# Altium project phase-4-badge.PrjPcb
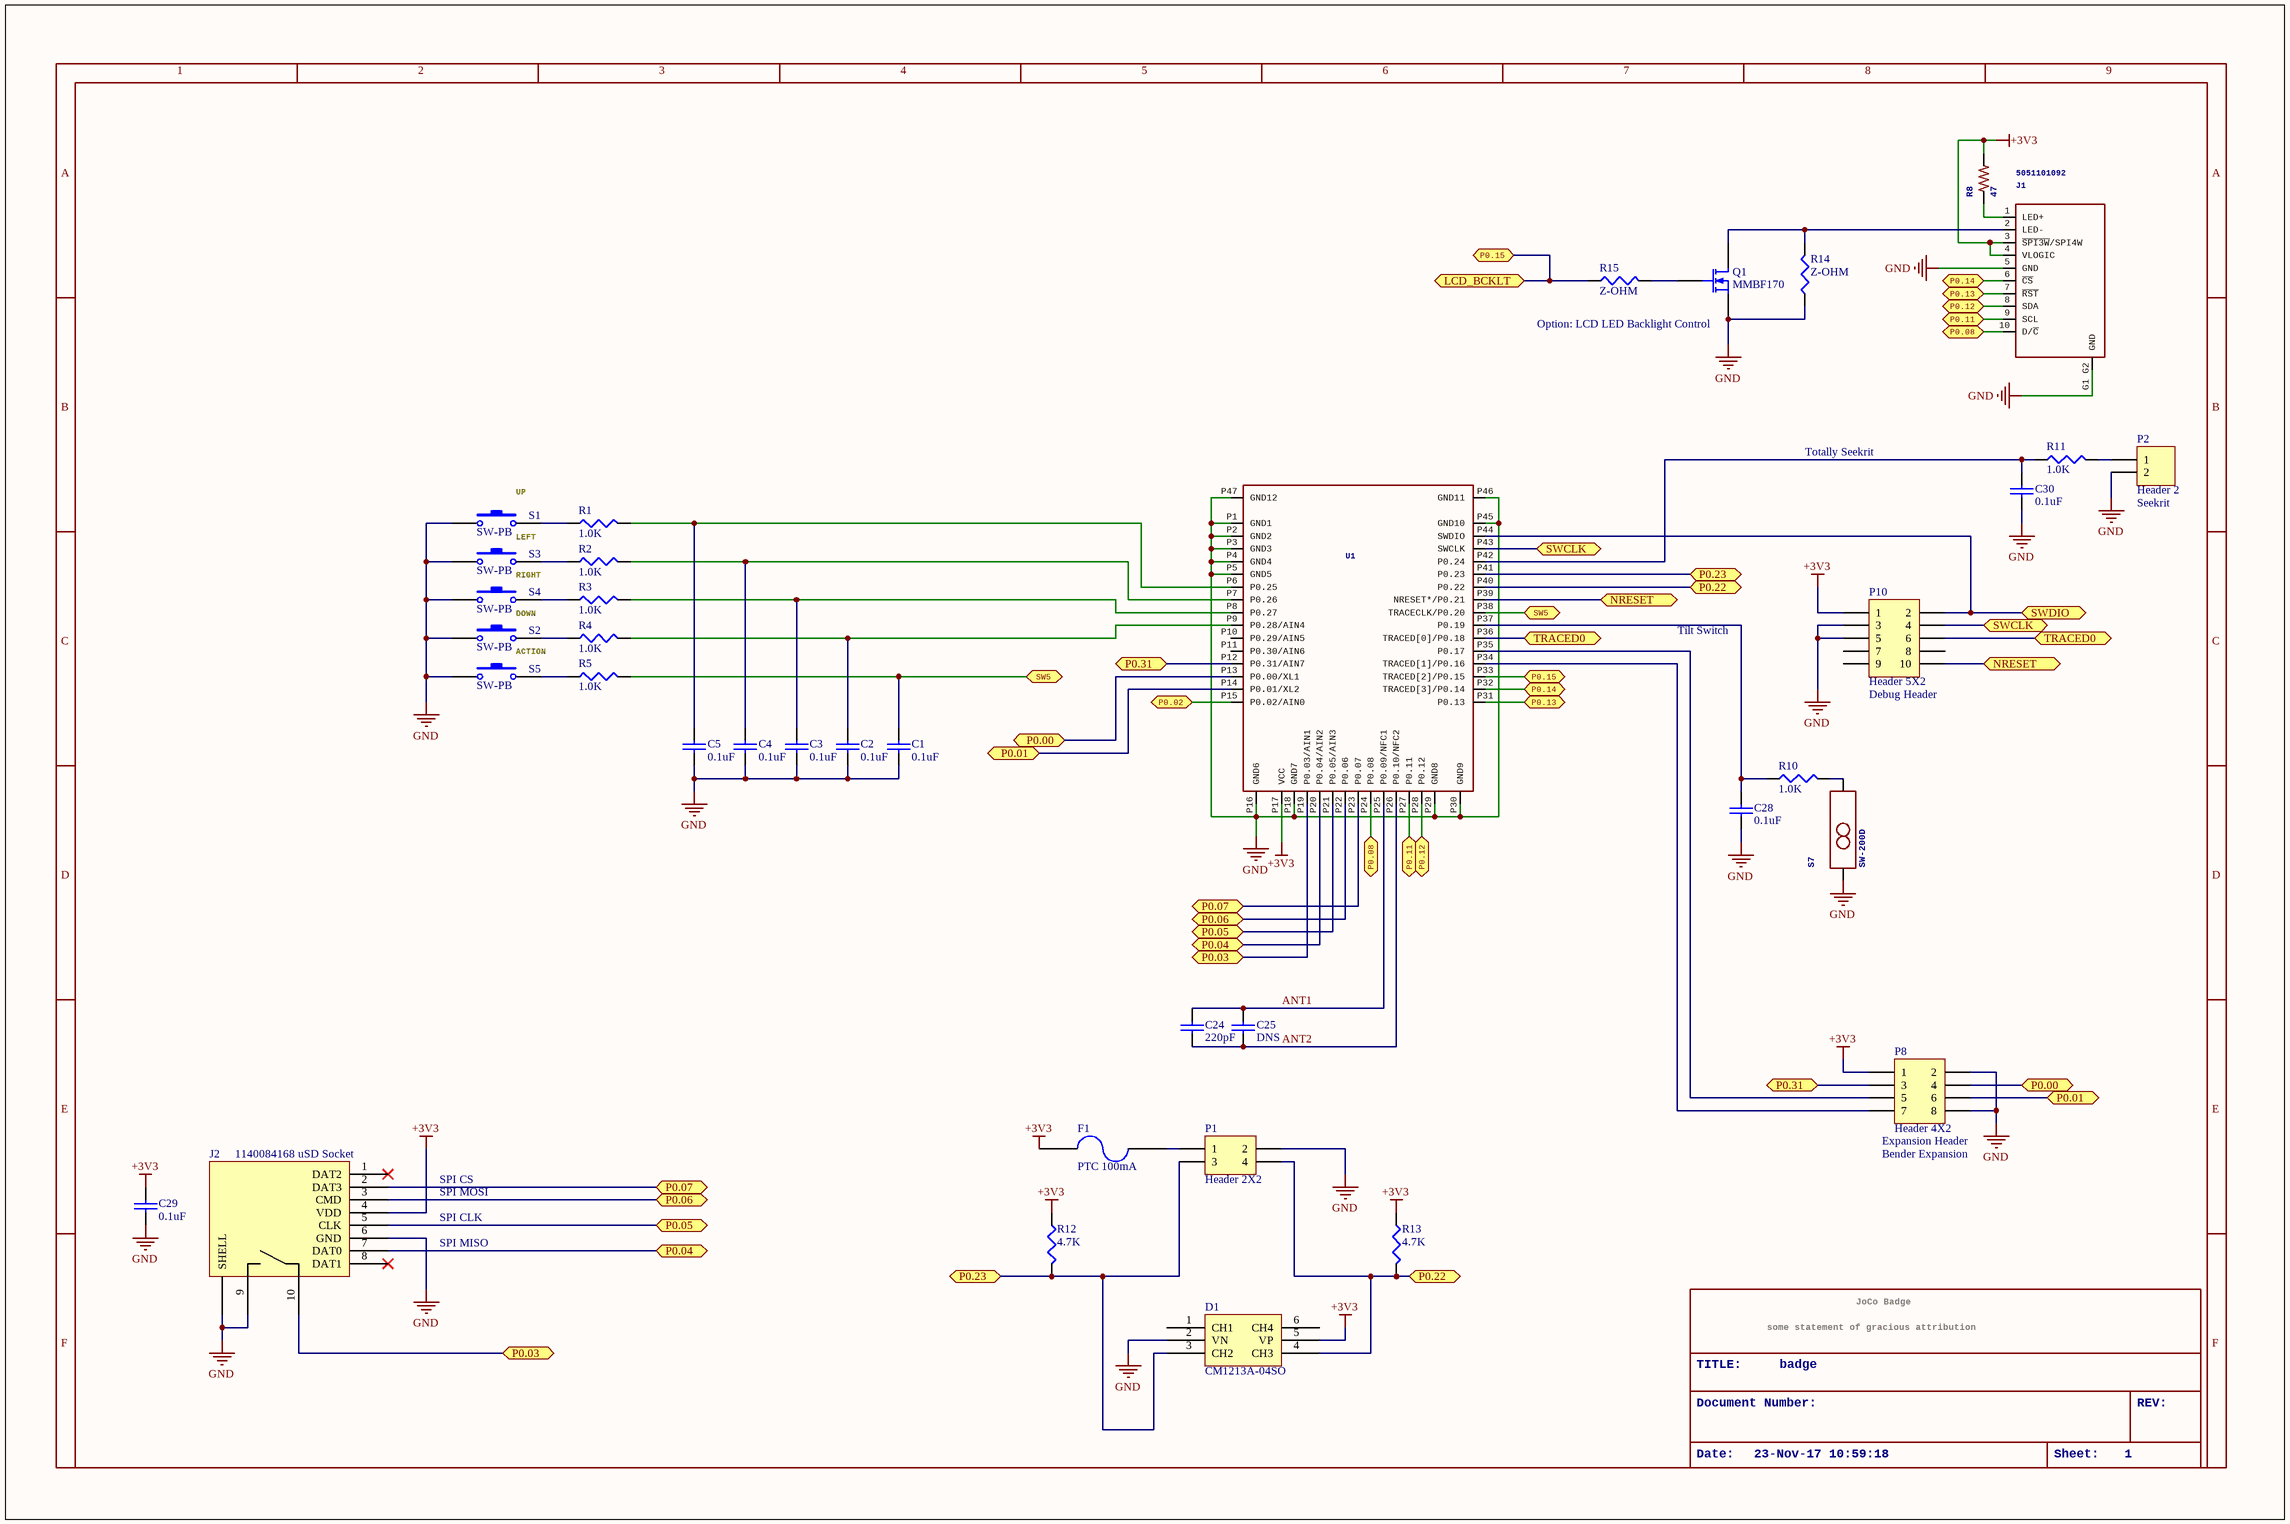
[diagram p0: p4b-processor.SchDoc]
3 sheets, 89 parts. Net scope: global (net labels, ports and power ports of the same name join across sheets).
Sheets:
  p4b-processor.SchDoc
  p4b-power.SchDoc
  p4b-leds.SchDoc

## Sheet p4b-processor.SchDoc: badge
size 453 x 301 mm; Date: 23-Nov-17 10:59:18; SheetNumber: 1; PageSetup: Record=PageOptions|CenterHorizontal=True|CenterVertical=True|PrintScale=0.61|XCorrection=1.00|YCorrection=1.00|PrintKind=0|BorderSize=5000000|LeftOffset=0|BottomOffset=0|Orientation=2|PaperLength=1000|PaperWidth=1000|Scale=100|PaperSource=7|PrintQuality=-3|MediaType=1|DitherType=10|PrintScaleMode=1|PaperKind=Letter|PaperIndex=1

### Parts
C1  value 0.1uF  [C0603]  (hidden comment: VALUE)
C2  value 0.1uF  [C0603]  (hidden comment: VALUE)
C3  value 0.1uF  [C0603]  (hidden comment: VALUE)
C4  value 0.1uF  [C0603]  (hidden comment: VALUE)
C5  value 0.1uF  [C0603]  (hidden comment: VALUE)
C24  value 220pF  [C0603]  (hidden comment: VALUE)
C25  value DNS  [C0603]  (hidden comment: VALUE)
C28  value 0.1uF  [C0603]  (hidden comment: VALUE)
C29  value 0.1uF  [C0603]  (hidden comment: VALUE)
C30  value 0.1uF  [C0603]  (hidden comment: VALUE)
D1  CM1213A-04SO  [SOT23-6]
F1  PTC 100mA  [R0805]
J1  5051101092  [5051101092]
J2  1140084168 uSD Socket  [1140084168 uSD Socket]
P1  Header 2X2  [HDR2X2]
P2  Header 2  [HDR1X2]
P8  Header 4X2  [HDR2X4]
P10  Header 5X2  [HEADER-2X5-050]
Q1  MMBF170  [SOT23]
R1  1.0K  [R0603]
R2  1.0K  [R0603]
R3  1.0K  [R0603]
R4  1.0K  [R0603]
R5  1.0K  [R0603]
R8  47  [R0603]
R10  1.0K  [R0603]
R11  1.0K  [R0603]
R12  4.7K  [R0603]
R13  4.7K  [R0603]
R14  Z-OHM  [R0603]
R15  Z-OHM  [R0603]
S1  SW-PB  [PTS810]
S2  SW-PB  [PTS810]
S3  SW-PB  [PTS810]
S4  SW-PB  [PTS810]
S5  SW-PB  [PTS810]
S7  SW-200D  [SW-200D-0.5]
U1  BMD-300  [BMD-300]  (value not drawn)

### Ports
LCD_BCKLT, NRESET, P0.00, P0.01, P0.02, P0.03, P0.04, P0.05, P0.06, P0.07, P0.08, P0.11, P0.12, P0.13, P0.14, P0.15, P0.22, P0.23, P0.31, SW5, SWCLK, SWDIO, TRACED0

### Nets
+3V3: C29.1(A) D1.5(VP) F1.1 J1.3(~{SPI3W}/SPI4W) J1.4(VLOGIC) J2.4(VDD) P8.1 P10.1 R8.2 R12.1(A) R13.1(A) U1.P17(VCC)
GND: C1.2(B) C2.2(B) C3.2(B) C4.2(B) C5.2(B) C28.2(B) C29.2(B) C30.2(B) D1.2(VN) J1.5(GND) J1.G1_G2(GND) J2.0(SHELL) J2.6(GND) J2.9 P1.2 P2.2 P8.2 P8.8 P10.3 P10.5 Q1.2(S) R14.1(A) S1.1,_2 S2.1,_2 S3.1,_2 S4.1,_2 S5.1,_2 S7.2 U1.P1(GND1) U1.P2(GND2) U1.P3(GND3) U1.P4(GND4) U1.P5(GND5) U1.P16(GND6) U1.P18(GND7) U1.P29(GND8) U1.P30(GND9) U1.P45(GND10) U1.P46(GND11) U1.P47(GND12)
ANT1: C24.1(A) C25.1(A) U1.P25(P0.09/NFC1)
ANT2: C24.2(B) C25.2(B) U1.P26(P0.10/NFC2)
NetC1_1: C1.1(A) R5.2(B) U1.P38(TRACECLK/P0.20) ; port SW5
NetC2_1: C2.1(A) R4.2(B) U1.P9(P0.28/AIN4)
NetC3_1: C3.1(A) R3.2(B) U1.P8(P0.27)
NetC4_1: C4.1(A) R2.2(B) U1.P7(P0.26)
NetC5_1: C5.1(A) R1.2(B) U1.P6(P0.25)
NetC28_1: C28.1(A) R10.1(A) U1.P37(P0.19)
NetC30_1: C30.1(A) R11.1(A) U1.P42(P0.24)
NetD1_3: D1.3(CH2) P1.3 R12.2(B) U1.P41(P0.23) ; port P0.23
NetD1_4: D1.4(CH3) P1.4 R13.2(B) U1.P40(P0.22) ; port P0.22
NetF1_2: F1.2 P1.1
NetJ1_1: J1.1(LED+) R8.1
NetJ1_2: J1.2(LED-) Q1.3(D) R14.2(B)
NetJ1_6: J1.6(~{CS}) U1.P32(TRACED[3]/P0.14) ; port P0.14
NetJ1_7: J1.7(~{RST}) U1.P31(P0.13) ; port P0.13
NetJ1_8: J1.8(SDA) U1.P28(P0.12) ; port P0.12
NetJ1_9: J1.9(SCL) U1.P27(P0.11) ; port P0.11
NetJ1_10: J1.10(D/~{C}) U1.P24(P0.08) ; port P0.08
NetJ2_2: J2.2(DAT3) U1.P23(P0.07) ; port P0.07
NetJ2_3: J2.3(CMD) U1.P22(P0.06) ; port P0.06
NetJ2_5: J2.5(CLK) U1.P21(P0.05/AIN3) ; port P0.05
NetJ2_7: J2.7(DAT0) U1.P20(P0.04/AIN2) ; port P0.04
NetJ2_10: J2.10 U1.P19(P0.03/AIN1) ; port P0.03
NetP2_1: P2.1 R11.2(B)
NetP8_3: P8.3 U1.P12(P0.31/AIN7) ; port P0.31
NetP8_4: P8.4 U1.P13(P0.00/XL1) ; port P0.00
NetP8_5: P8.5 U1.P35(P0.17)
NetP8_6: P8.6 U1.P14(P0.01/XL2) ; port P0.01
NetP8_7: P8.7 U1.P34(TRACED[1]/P0.16)
NetP10_2: P10.2 U1.P44(SWDIO) ; port SWDIO
NetP10_4: P10.4 U1.P43(SWCLK) ; port SWCLK
NetP10_6: P10.6 U1.P36(TRACED[0]/P0.18) ; port TRACED0
NetP10_10: P10.10 U1.P39(NRESET*/P0.21) ; port NRESET
NetQ1_1: Q1.1(G) R15.2(B)
NetR1_1: R1.1(A) S1.3,_4
NetR2_1: R2.1(A) S3.3,_4
NetR3_1: R3.1(A) S4.3,_4
NetR4_1: R4.1(A) S2.3,_4
NetR5_1: R5.1(A) S5.3,_4
NetR9_1: U1.P15(P0.02/AIN0) ; port P0.02
NetR10_2: R10.2(B) S7.1
NetR15_1: R15.1(A) U1.P33(TRACED[2]/P0.15) ; port P0.15, port LCD_BCKLT

Not connected (* = marked no-connect by the designer): D1 1(CH1) 6(CH4); J2 1(DAT2)* 8(DAT1)*; P10 7 8 9; U1 P10(P0.29/AIN5) P11(P0.30/AIN6)

### Notes on the sheet
- Option: LCD LED Backlight Control
- Totally Seekrit
- (near S1) UP
- (near P2) Seekrit
- LEFT
- RIGHT
- DOWN
- ACTION
- Tilt Switch
- (near P10) Debug Header
- (near P8) Expansion Header
- (near P8) Bender Expansion
- SPI CLK
- SPI CS
- SPI MOSI
- SPI MISO
- some statement of gracious attribution
- JoCo Badge
- TITLE:
- Document Number:
- badge
- REV:
- Date:
- 23-Nov-17 10:59:18
- Sheet:
- 1
- 2
- 3
- 4
- 5
- 6
- 7
- 8
- 9
- A
- B
- C
- D
- E
- F

### Library data of the parts
C1-C5 C28-C30 = CAP-0.1UF-0603: CAP, CER, 0.1UF, 6.3v, 10%, X5R, 0603
C24 = CAP-0.1UF-0603: CAP, CER, 220pF, 6.3v, 10%, X5R, 0603
C25 = CAP-0.1UF-0603: CAP, CER, TBD, 6.3v, 10%, X5R, 0603
D1 = CM1213A-04SO TVS: VENDOR: Digikey; VENDOR_PN: CM1213A-04SOOSCT-ND; MFG: ON Semi; MFG_PN: CM1213A-04SO; VENDOR_LINK: https://www.digikey.com/product-detail/en/on-semiconductor/CM1213A-04SO/CM1213A-04SOOSCT-ND/2704992; VALUE: CM1213A-04SO; MFG_LINK: http://www.onsemi.com/pub/Collateral/CM1213A-04SO-D.PDF
F1 = Fuse, PTC 150mA: Fuse, PTC 100mA, 0805; VENDOR: Digikey; VENDOR_PN: 490-14327-1-ND; MFG: Murata; MFG_PN: PRG21AR420MS1RA; VENDOR_LINK: https://www.digikey.com/product-detail/en/murata-electronics-north-america/PRG21AR420MS1RA/490-14327-1-ND/6559793; VALUE: PTC 100mA; MFG_LINK: https://www.murata.com/~/media/webrenewal/products/thermistor/ptc/prg/bc-e0210d-prg21ar420ms1ra-e.ashx?la=en-us
J1 = 5051101092: GateName_1: G$1; SymbolName_1: CONN-10; LibraryName: badge; DeviceSetName: 5051101092
J2 = 1140084168-uSD-Socket: MFG: Amp; MFG_PN: 114-00841-68; VENDOR: Digikey; VENDOR_PN: 114-00841-68-1-ND; MFG_LINK: https://www.amphenolcanada.com/ProductSearch/drawings/AC/1140084168.pdf; VENDOR_LINK: https://www.digikey.com/product-detail/en/amphenol-commercial-products/114-00841-68/114-00841-68-1-ND/2187101; VALUE: 1140084168 uSD Socket
P1 = Header 2X2: Header, 2-Pin, Dual row; LatestRevisionDate: 17-Jul-2002; LatestRevisionNote: Re-released for DXP Platform.; Publisher: Altium Limited
P2 = Header 2: Header, 2-Pin; LatestRevisionDate: 17-Jul-2002; LatestRevisionNote: Re-released for DXP Platform.; Publisher: Altium Limited
P8 = Header 4X2: Header, 4-Pin, Dual row; LatestRevisionDate: 17-Jul-2002; LatestRevisionNote: Re-released for DXP Platform.; Publisher: Altium Limited
P10 = Header 5X2: Header, 5-Pin, Dual row; LatestRevisionDate: 17-Jul-2002; LatestRevisionNote: Re-released for DXP Platform.; Publisher: Altium Limited
Q1 = MMBF170-7-F: DK_PN: MMBF170-FDICT-ND; MFG_PN: MMBF170-7-F
R1-R5 R10 R11 = RES-1.0K-0603: RES, 1.0K, 1/10W, 5%, 0603 SMD; VALUE: 1.0K
R8 = R-US_R0603: RESISTOR, American symbol; GateName_1: G$1; SymbolName_1: R-US; DeviceSetName: R-US_; DeviceName: R0603; LibraryName: rcl
R12 R13 = RES, 10K, 0603: RES, 4.7K OHM, 1/10W, 1%, 0603 SMD; VENDOR: Digikey; VALUE: 4.7K
R14 R15 = RES-Z-0603: RES, Z-OHM, 0603 SMD; VALUE: Z-OHM
S1-S5 = SW-PB: Switch; Published: 24-Mar-1999; LatestRevisionDate: 17-Jul-2002; LatestRevisionNote: Re-released for DXP Platform.; PackageReference: SPST-2; Publisher: Altium Limited; PackageDescription: Switch; 2 Leads
S7 = SW-200D: GateName_1: G$1; SymbolName_1: ROLL-SW; LibraryName: badge; DeviceSetName: SW-200D
U1 = BMD-300: GateName_1: G$1; SymbolName_1: BMD-300; LibraryName: BMD-300; DeviceSetName: BMD-300

## Sheet p4b-power.SchDoc
size A; PageSetup: Record=PageOptions|CenterHorizontal=True|CenterVertical=True|PrintScale=1.11|XCorrection=1.00|YCorrection=1.00|PrintKind=0|BorderSize=5000000|LeftOffset=0|BottomOffset=0|Orientation=2|PaperLength=1000|PaperWidth=1000|Scale=100|PaperSource=7|PrintQuality=-3|MediaType=1|DitherType=10|PrintScaleMode=1|PaperKind=Letter|PaperIndex=1
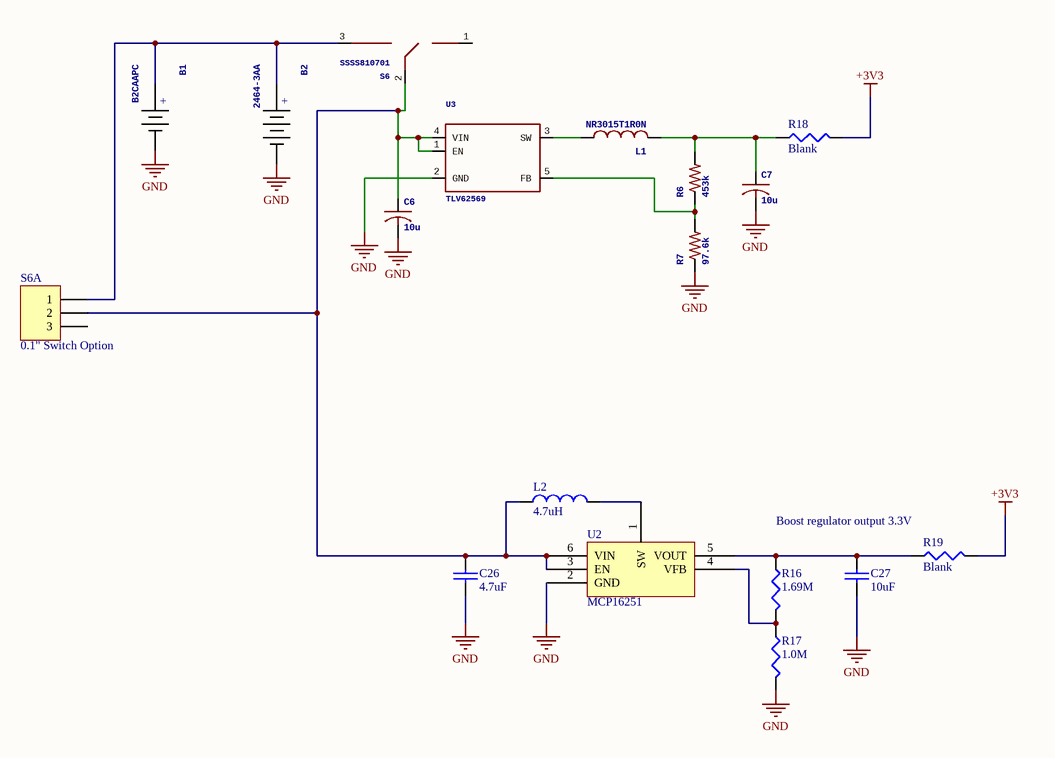
[diagram p1: p4b-power.SchDoc]

### Parts
B1  B2CAAPC  [B2CAAPC]
B2  2464-3AA  [2464-3AA]
C6  10u  [C0805]
C7  10u  [C0805]
C26  value 4.7uF  [C0805]  (hidden comment: VALUE)
C27  value 10uF  [C0805]  (hidden comment: VALUE)
L1  NR3015T1R0N  [NR3015]
L2  4.7uH  [WURTH-WE-TOC-2.8X2.8]
R6  453k  [R0603]
R7  97.6k  [R0603]
R16  1.69M  [R0603]
R17  1.0M  [R0603]
R18  Blank  [R0603]
R19  Blank  [R0603]
S6  SSSS810701  [SSSS810701]
S6A  0.1" Switch Option  [HDR1X3]
U2  MCP16251  [SOT23-6]
U3  TLV62569  [DBV-5]

### Nets
+3V3: R18.2(B) R19.2(B)
GND: B1.2(GND) B2.2(GND) C6.2 C7.2 C26.2(B) C27.2(B) R7.1 R17.2(B) U2.2(GND) U3.2(GND)
NetB1_1: B1.1(POS) B2.1(POS) S6.3 S6A.1
NetC6_1: C6.1 C26.1(A) L2.1 S6.2 S6A.2 U2.3(EN) U2.6(VIN) U3.1(EN) U3.4(VIN)
NetC7_1: C7.1 L1.2 R6.2 R18.1(A)
NetC27_1: C27.1(A) R16.1(A) R19.1(A) U2.5(VOUT)
NetL1_1: L1.1 U3.3(SW)
NetL2_2: L2.2 U2.1(SW)
NetR6_1: R6.1 R7.2 U3.5(FB)
NetR16_2: R16.2(B) R17.1(A) U2.4(VFB)

Not connected (* = marked no-connect by the designer): S6 1; S6A 3

### Notes on the sheet
- Boost regulator output 3.3V
- (in symbol 2464-3AA) +
- (in symbol B2CAAPC) +

### Library data of the parts
B1 = B2CAAPC: GateName_1: G$1; SymbolName_1: BATT-HOLDER; DeviceSetName: 12BH331P-GR; VENDOR: Digikey; LibraryName: badge; VALUE: B2CAAPC; VENDOR_PN: https://www.digikey.com/product-detail/en/mpd-memory-protection-devices/BC2AAPC/BC2AAPC-ND/455777
B2 = 2464-3AA: GateName_1: G$1; SymbolName_1: BATT-HOLDER; DeviceSetName: 12BH331P-GR; VENDOR: Digikey; LibraryName: badge; VALUE: 2464-3AA; VENDOR_PN: https://www.digikey.com/product-detail/en/keystone-electronics/2464/36-2464-ND/303813
C6 C7 = C-USC0805K: CAPACITOR, American symbol; MPN: JMK212BJ106KD-T; GateName_1: G$1; SymbolName_1: C-US; DeviceName: C0805K; LibraryName: rcl; DeviceSetName: C-US
C26 = CAP-4.7UF-0805: CAP, CER, 4.7UF, 6.3v, 10%, X5R, 0805
C27 = CAP-10UF-0805: CAP, CER, 10UF, 6.3v, 10%, X5R, 0805
L1 = NR3015: GateName_1: G$1; SymbolName_1: L-US; LibraryName: badge; DeviceSetName: NR3015
L2 = IND-4.7UH-SMD-2.8X2.8: IND, 4.7UH, SMD; VENDOR_PN: 732-1089-1-ND; VENDOR: Digikey; MFG: Wurth; MFG_PN: 744029004; VENDOR_LINK: https://www.digikey.com/product-detail/en/wurth-electronics-inc/744029004/732-1089-1-ND/1639150; VALUE: 4.7uH
R6 R7 = R-US_R0603: as R8 on sheet p4b-processor; DeviceName: R0603; LibraryName: rcl
R16 = RES-1.69M-0603: RES, 1.69M, 1/10W, 1%, 0603 SMD; VALUE: 1.69M
R17 = RES-1.0M-0603: RES, 1.0M, 1/10W, 1%, 0603 SMD; VALUE: 1.0M
R18 R19 = RES, BLANK, 0603: RES, BLANK OHM, 1/10W, 1%, 0603 SMD; VENDOR: Digikey; VALUE: Blank
S6 = SSSS810701: GateName_1: G$1; SymbolName_1: PWSW; LibraryName: badge; DeviceSetName: SSSS810701
S6A = Header 3: Header, 3-Pin; LatestRevisionDate: 17-Jul-2002; LatestRevisionNote: Re-released for DXP Platform.; Publisher: Altium Limited
U2 = MCP16251-SOT23-6: MCP16251, IC REG, BST 0.65A; MFG: Microchip; MFG_PN: MCP16251T-I/CH; VENDOR: Digikey; VENDOR_PN: MCP16251T-I/CHCT-ND; MFG_LINK: http://www.microchip.com/mymicrochip/filehandler.aspx?ddocname=en561096; VENDOR_LINK: https://www.digikey.com/product-detail/en/microchip-technology/MCP16251T-I-CH/MCP16251T-I-CHCT-ND/4277532; VALUE: MCP16251
U3 = TLV62569: GateName_1: G$1; SymbolName_1: TLV62569; LibraryName: badge; DeviceSetName: TLV62569

## Sheet p4b-leds.SchDoc
size A; PageSetup: Record=PageOptions|CenterHorizontal=True|CenterVertical=True|PrintScale=1.11|XCorrection=1.00|YCorrection=1.00|PrintKind=0|BorderSize=5000000|LeftOffset=0|BottomOffset=0|Orientation=2|PaperLength=1000|PaperWidth=1000|Scale=100|PaperSource=7|PrintQuality=-3|MediaType=1|DitherType=10|PrintScaleMode=1|PaperKind=Letter|PaperIndex=1
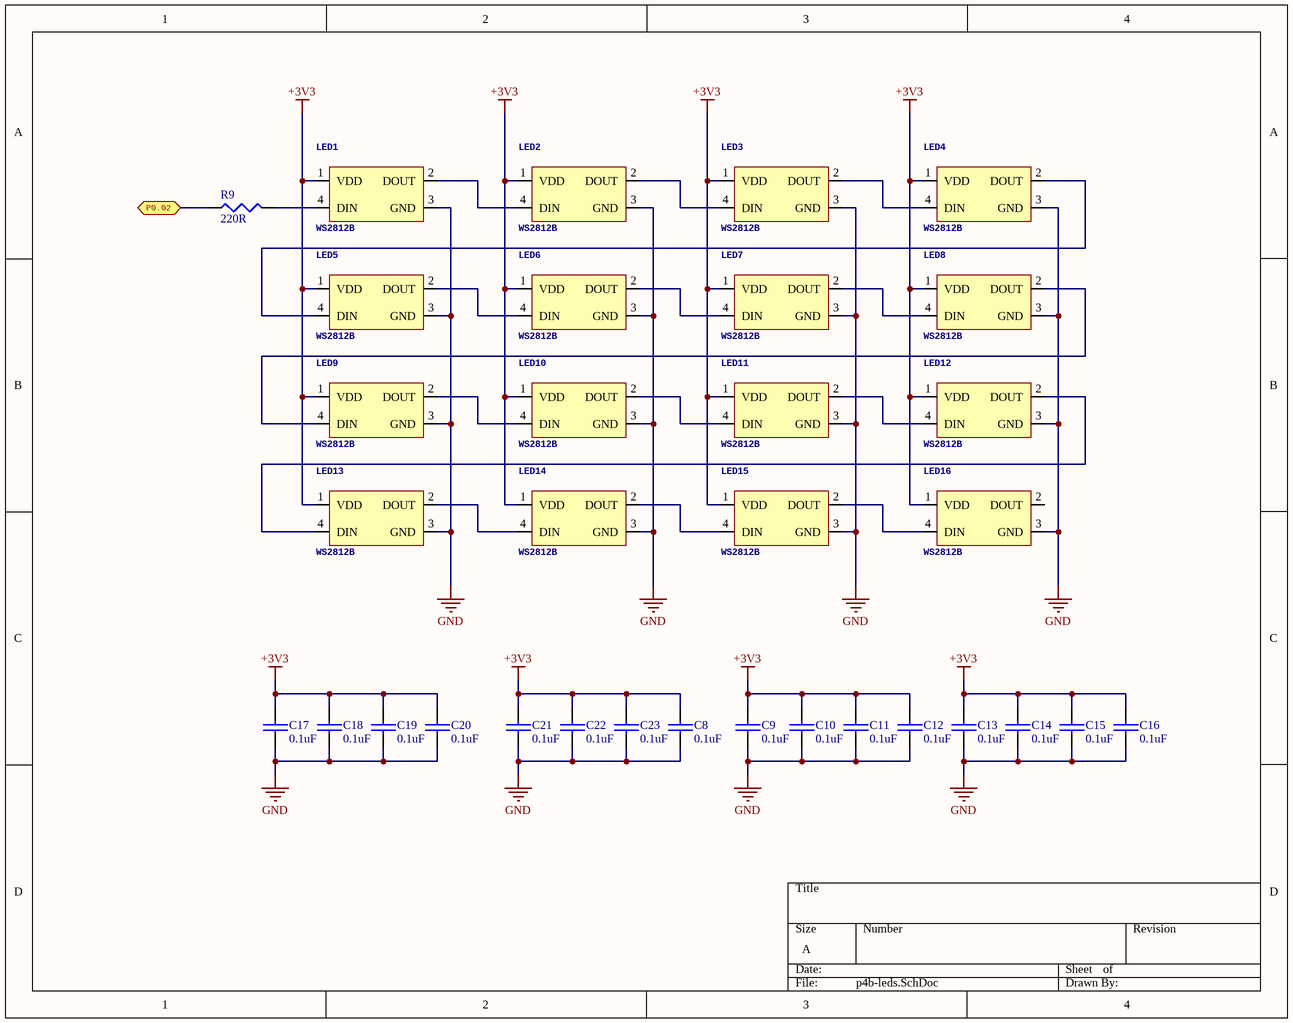
[diagram p2: p4b-leds.SchDoc]

### Parts
C8  value 0.1uF  [C0603]  (hidden comment: VALUE)
C9  value 0.1uF  [C0603]  (hidden comment: VALUE)
C10  value 0.1uF  [C0603]  (hidden comment: VALUE)
C11  value 0.1uF  [C0603]  (hidden comment: VALUE)
C12  value 0.1uF  [C0603]  (hidden comment: VALUE)
C13  value 0.1uF  [C0603]  (hidden comment: VALUE)
C14  value 0.1uF  [C0603]  (hidden comment: VALUE)
C15  value 0.1uF  [C0603]  (hidden comment: VALUE)
C16  value 0.1uF  [C0603]  (hidden comment: VALUE)
C17  value 0.1uF  [C0603]  (hidden comment: VALUE)
C18  value 0.1uF  [C0603]  (hidden comment: VALUE)
C19  value 0.1uF  [C0603]  (hidden comment: VALUE)
C20  value 0.1uF  [C0603]  (hidden comment: VALUE)
C21  value 0.1uF  [C0603]  (hidden comment: VALUE)
C22  value 0.1uF  [C0603]  (hidden comment: VALUE)
C23  value 0.1uF  [C0603]  (hidden comment: VALUE)
LED1  WS2812B  [WS2812B]
LED2  WS2812B  [WS2812B]
LED3  WS2812B  [WS2812B]
LED4  WS2812B  [WS2812B]
LED5  WS2812B  [WS2812B]
LED6  WS2812B  [WS2812B]
LED7  WS2812B  [WS2812B]
LED8  WS2812B  [WS2812B]
LED9  WS2812B  [WS2812B]
LED10  WS2812B  [WS2812B]
LED11  WS2812B  [WS2812B]
LED12  WS2812B  [WS2812B]
LED13  WS2812B  [WS2812B]
LED14  WS2812B  [WS2812B]
LED15  WS2812B  [WS2812B]
LED16  WS2812B  [WS2812B]
R9  220R  [R0603]

### Ports
P0.02

### Nets
+3V3: C8.1(A) C9.1(A) C10.1(A) C11.1(A) C12.1(A) C13.1(A) C14.1(A) C15.1(A) C16.1(A) C17.1(A) C18.1(A) C19.1(A) C20.1(A) C21.1(A) C22.1(A) C23.1(A) LED1.1(VDD) LED2.1(VDD) LED3.1(VDD) LED4.1(VDD) LED5.1(VDD) LED6.1(VDD) LED7.1(VDD) LED8.1(VDD) LED9.1(VDD) LED10.1(VDD) LED11.1(VDD) LED12.1(VDD) LED13.1(VDD) LED14.1(VDD) LED15.1(VDD) LED16.1(VDD)
GND: C8.2(B) C9.2(B) C10.2(B) C11.2(B) C12.2(B) C13.2(B) C14.2(B) C15.2(B) C16.2(B) C17.2(B) C18.2(B) C19.2(B) C20.2(B) C21.2(B) C22.2(B) C23.2(B) LED1.3(GND) LED2.3(GND) LED3.3(GND) LED4.3(GND) LED5.3(GND) LED6.3(GND) LED7.3(GND) LED8.3(GND) LED9.3(GND) LED10.3(GND) LED11.3(GND) LED12.3(GND) LED13.3(GND) LED14.3(GND) LED15.3(GND) LED16.3(GND)
NetLED1_2: LED1.2(DOUT) LED2.4(DIN)
NetLED1_4: LED1.4(DIN) R9.2(B)
NetLED2_2: LED2.2(DOUT) LED3.4(DIN)
NetLED3_2: LED3.2(DOUT) LED4.4(DIN)
NetLED4_2: LED4.2(DOUT) LED5.4(DIN)
NetLED5_2: LED5.2(DOUT) LED6.4(DIN)
NetLED6_2: LED6.2(DOUT) LED7.4(DIN)
NetLED7_2: LED7.2(DOUT) LED8.4(DIN)
NetLED8_2: LED8.2(DOUT) LED9.4(DIN)
NetLED9_2: LED9.2(DOUT) LED10.4(DIN)
NetLED10_2: LED10.2(DOUT) LED11.4(DIN)
NetLED11_2: LED11.2(DOUT) LED12.4(DIN)
NetLED12_2: LED12.2(DOUT) LED13.4(DIN)
NetLED13_2: LED13.2(DOUT) LED14.4(DIN)
NetLED14_2: LED14.2(DOUT) LED15.4(DIN)
NetLED15_2: LED15.2(DOUT) LED16.4(DIN)
NetR9_1: R9.1(A) ; port P0.02

Not connected (* = marked no-connect by the designer): LED16 2(DOUT)

### Library data of the parts
C8-C23 = CAP-0.1UF-0603: CAP, CER, 0.1UF, 6.3v, 10%, X5R, 0603
LED1-LED16 = WS2812B: WS2812B RGB LED; VENDOR: BTF-lighting; VALUE: WS2812B; MFG_PN: WS2812B; VENDOR_PN: WS2812B; VENDOR_LINK: https://www.aliexpress.com/store/product/10-1000pcs-WS2812B-4pins-5050-SMD-Black-White-version-WS2812-Individually-Addressable-Digital-RGB-LED-Chip/1051119_32453497583.html?spm=2114.12010608.0.0.75ad4df1qQP28f
R9 = RES-47-0603: RES, 220 OHM, 1/10W, 5%, 0603 SMD; VALUE: 220R

## Nets that join several sheets
+3V3: p4b-processor (12 pins), p4b-power (R18.2 R19.2), p4b-leds (32 pins)
GND: p4b-processor (40 pins), p4b-power (10 pins), p4b-leds (32 pins)
NetR9_1: p4b-processor (U1.P15), p4b-leds (R9.1)